# EAGLE design rpiz_test (EAGLE 7.6.0)
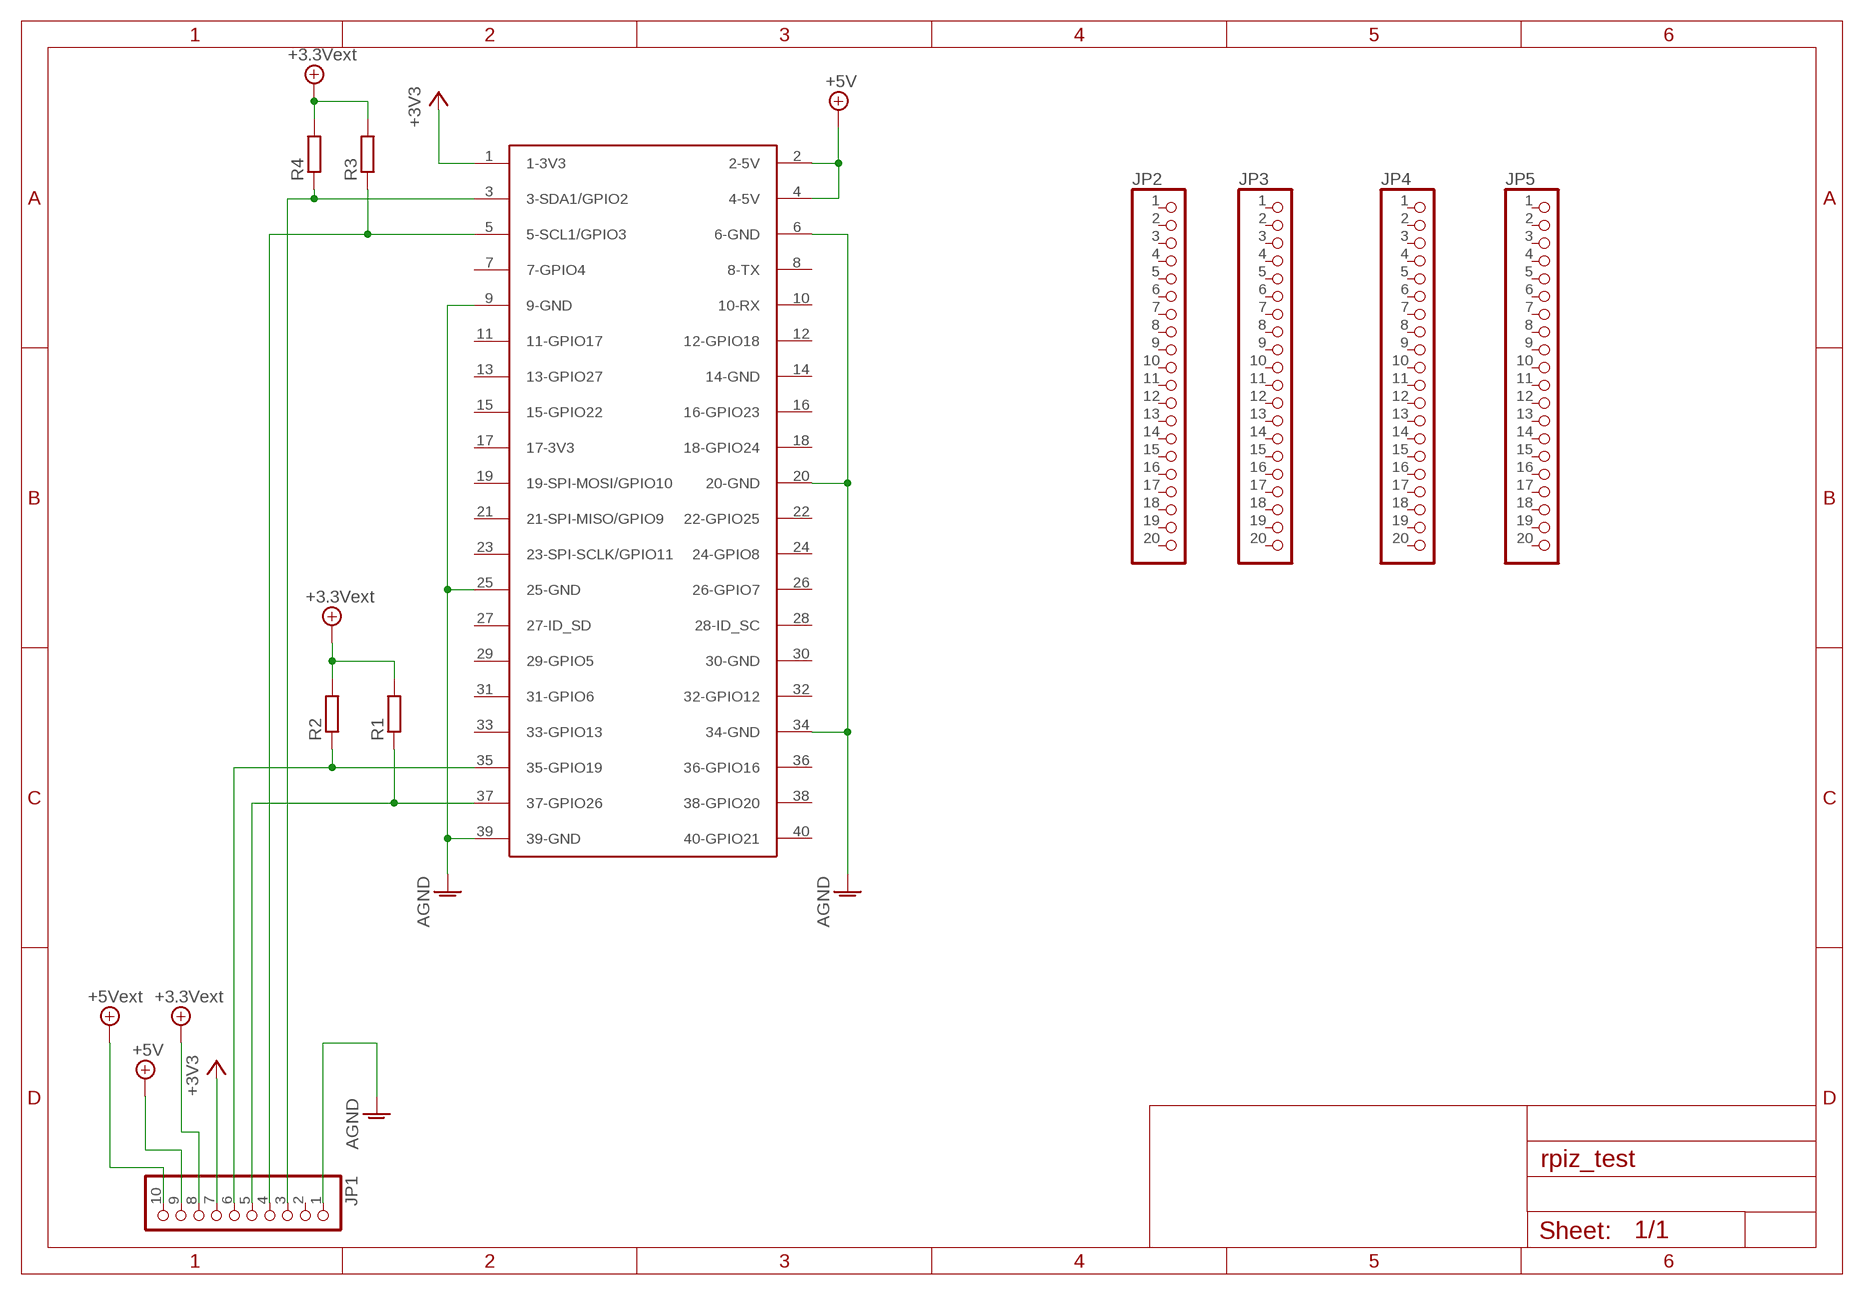
[diagram p0: schematic, sheet 1]

## Parts
JP1  PINHD-1X10  [1X10]
JP2  PINHD-1X20  [1X20]
JP3  PINHD-1X20  [1X20]
JP4  PINHD-1X20  [1X20]
JP5  PINHD-1X20  [1X20]
R1  R-EU_R0805  [R0805]
R2  R-EU_R0805  [R0805]
R3  R-EU_R0805  [R0805]
R4  R-EU_R0805  [R0805]
U$1  RASPBERRY-PI+PIZERO  [RASPBERRY-PI-ZERO]

## Nets
3.3VEXT: JP1.8 R1.2 R2.2 R3.2 R4.2 ; supply symbol labelled +3.3Vext
+3V3: JP1.7 U$1.1(1-3V3)
+5V: JP1.9 U$1.2(2-5V) U$1.4(4-5V)
+5V/1: JP1.10 ; supply symbol labelled +5Vext
AGND: JP1.1 U$1.6(6-GND) U$1.9(9-GND) U$1.20(20-GND) U$1.25(25-GND) U$1.34(34-GND) U$1.39(39-GND)
N$1: JP1.3 R4.1 U$1.3(3-SDA1/GPIO2)
N$2: JP1.4 R3.1 U$1.5(5-SCL1/GPIO3)
N$3: JP1.5 R1.1 U$1.37(37-GPIO26)
N$4: JP1.6 R2.1 U$1.35(35-GPIO19)
Unconnected: JP1.2 JP2.1 JP2.2 JP2.3 JP2.4 JP2.5 JP2.6 JP2.7 JP2.8 JP2.9 JP2.10 JP2.11 JP2.12 JP2.13 JP2.14 JP2.15 JP2.16 JP2.17 JP2.18 JP2.19 JP2.20 JP3.1 JP3.2 JP3.3 JP3.4 JP3.5 JP3.6 JP3.7 JP3.8 JP3.9 JP3.10 JP3.11 JP3.12 JP3.13 JP3.14 JP3.15 JP3.16 JP3.17 JP3.18 JP3.19 JP3.20 JP4.1 JP4.2 JP4.3 JP4.4 JP4.5 JP4.6 JP4.7 JP4.8 JP4.9 JP4.10 JP4.11 JP4.12 JP4.13 JP4.14 JP4.15 JP4.16 JP4.17 JP4.18 JP4.19 JP4.20 JP5.1 JP5.2 JP5.3 JP5.4 JP5.5 JP5.6 JP5.7 JP5.8 JP5.9 JP5.10 JP5.11 JP5.12 JP5.13 JP5.14 JP5.15 JP5.16 JP5.17 JP5.18 JP5.19 JP5.20 U$1.7(7-GPIO4) U$1.8(8-TX) U$1.10(10-RX) U$1.11(11-GPIO17) U$1.12(12-GPIO18) U$1.13(13-GPIO27) U$1.14(14-GND) U$1.15(15-GPIO22) U$1.16(16-GPIO23) U$1.17(17-3V3) U$1.18(18-GPIO24) U$1.19(19-SPI-MOSI/GPIO10) U$1.21(21-SPI-MISO/GPIO9) U$1.22(22-GPIO25) U$1.23(23-SPI-SCLK/GPIO11) U$1.24(24-GPIO8) U$1.26(26-GPIO7) U$1.27(27-ID_SD) U$1.28(28-ID_SC) U$1.29(29-GPIO5) U$1.30(30-GND) U$1.31(31-GPIO6) U$1.32(32-GPIO12) U$1.33(33-GPIO13) U$1.36(36-GPIO16) U$1.38(38-GPIO20) U$1.40(40-GPIO21)

## Library data of the parts
JP1 = pinhead:PINHD-1X10: PIN HEADER
JP2-JP5 = pinhead:PINHD-1X20: PIN HEADER
R1-R4 = rcl:R-EU_: RESISTOR, European symbol
U$1 = Ava:RASPBERRY-PI+: Samtec SSW-120-01-T-D

## Board
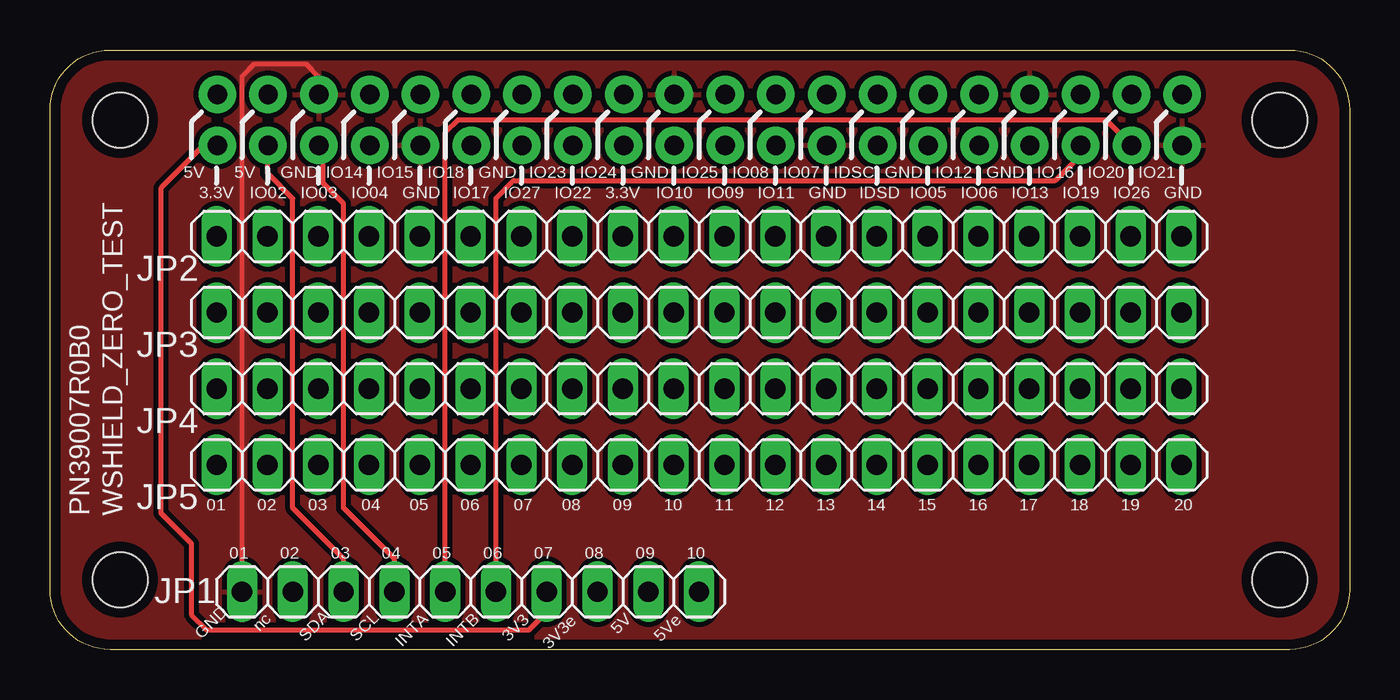
[diagram p1: board, top side]
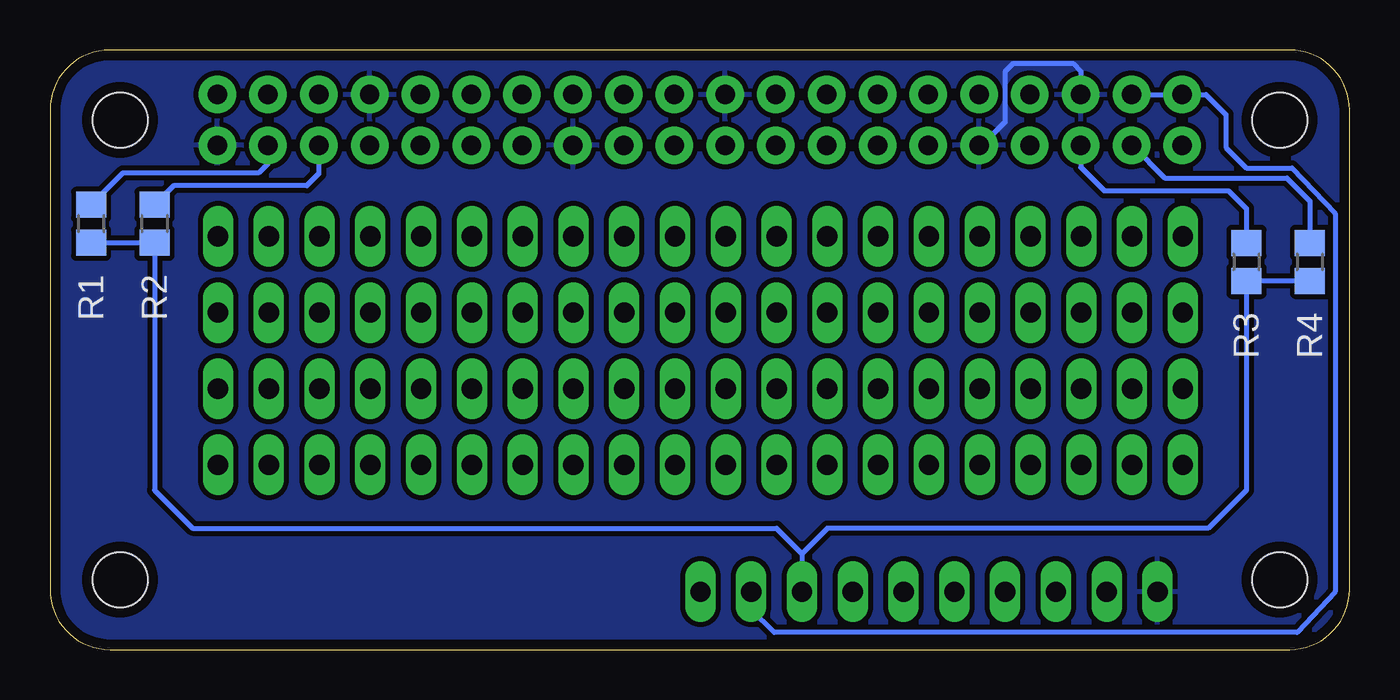
[diagram p2: board, bottom side, seen from below]

Size 65 x 30 mm. Coordinates in mm from the lower left corner, seen from the top.
Copper layers (1*16): Top 0.035mm / dielectric 1.6mm / Bottom 0.035mm
Design rules "Elecrow_2-layer_PCB_eagle_rule": minimum track width 6mil, minimum drill 12mil, track to track 6mil, track to pad 6mil, pad to pad 6mil, via to via 8mil, smd to smd 0mil, copper to edge 20mil, drill to drill 10mil, minimum pad ring 6mil, minimum via ring 6mil, stop-mask expansion 0mil, vias tented up to drill 100mil, thermal gap 10mil

### Footprints (pad centres in the part's own frame; a part is rotated, then mirrored left to right if it is on the bottom)
1X10 = drill 1.016 long: 1 -11.43,0; 2 -8.89,0; 3 -6.35,0; 4 -3.81,0; 5 -1.27,0; 6 1.27,0; 7 3.81,0; 8 6.35,0; 9 8.89,0; 10 11.43,0
1X20 = drill 1.016 long: 1 -24.13,0; 2 -21.59,0; 3 -19.05,0; 4 -16.51,0; 5 -13.97,0; 6 -11.43,0; 7 -8.89,0; 8 -6.35,0; 9 -3.81,0; 10 -1.27,0; 11 1.27,0; 12 3.81,0; 13 6.35,0; 14 8.89,0; 15 11.43,0; 16 13.97,0; 17 16.51,0; 18 19.05,0; 19 21.59,0; 20 24.13,0
R0805 = smd 1.3 x 1.5: 1 -0.95,0; 2 0.95,0
RASPBERRY-PI-ZERO = drill 0.97 pad 1.88: 1 -23.97,23.23; 2 -23.97,25.77; 3 -21.43,23.23; 4 -21.43,25.77; 5 -18.89,23.23; 6 -18.89,25.77; 7 -16.35,23.23; 8 -16.35,25.77; 9 -13.81,23.23; 10 -13.81,25.77; 11 -11.27,23.23; 12 -11.27,25.77; 13 -8.73,23.23; 14 -8.73,25.77; 15 -6.19,23.23; 16 -6.19,25.77; 17 -3.65,23.23; 18 -3.65,25.77; 19 -1.11,23.23; 20 -1.11,25.77; 21 1.43,23.23; 22 1.43,25.77; 23 3.97,23.23; 24 3.97,25.77; 25 6.51,23.23; 26 6.51,25.77; 27 9.05,23.23; 28 9.05,25.77; 29 11.59,23.23; 30 11.59,25.77; 31 14.13,23.23; 32 14.14,25.77; 33 16.67,23.23; 34 16.67,25.77; 35 19.21,23.23; 36 19.21,25.77; 37 21.75,23.23; 38 21.75,25.77; 39 24.29,23.23; 40 24.29,25.77 | hole 2.75: -28.84,24.5; 29.16,24.5; -28.84,1.5; 29.16,1.5

### Placement (x,y rotation side)
JP1  21.04,2.89 0 top
JP2  32.47,20.67 0 top
JP3  32.47,16.86 0 top
JP4  32.47,13.05 0 top
JP5  32.47,9.24 0 top
R1  62.95,21.3 270 bottom
R2  59.77,21.3 270 bottom
R3  5.16,19.4 270 bottom
R4  1.99,19.4 270 bottom
U$1  32.34,2 0 top

### Tracks (layer width: path | path; a pad name or v marks a point on that pad's centre or on a via)
3.3VEXT
  Bottom 0.254: R4.2 R3.2 5.16,7.97 7.07,6.06 26.12,6.06 27.39,4.79 | R1.2 R2.2 59.77,7.97 57.87,6.06 28.66,6.06 27.39,4.79 | 27.39,4.79 JP1.8
+3V3
  Top 0.254: U$1.1 7.69,25.23 5.54,23.08 5.54,6.83 7.07,5.3 7.07,1.75 7.83,0.98 23.96,0.98 24.85,1.87 JP1.7
+5V
  Bottom 0.254: JP1.9 29.93,2 28.78,0.86 2.62,0.86 0.72,2.89 0.72,21.81 2.88,24.1 5.16,24.1 6.18,25.11 6.18,26.76 7.18,27.77 U$1.2 U$1.4
AGND
  Top 0.254: JP1.1 9.61,28.67 10.24,29.3 12.78,29.3 13.42,28.67 13.42,27.8 U$1.6
  Bottom 0.254: U$1.6 13.42,27.8 13.42,28.92 13.8,29.3 16.85,29.3 17.23,28.92 17.23,26.38 18.38,25.23 U$1.9
  pour Top (isolate 0.254): 0.08,27.02 arc-90 3.26,30.19 3.89,30.19 62.31,30.19 arc-90 64.85,27.65 64.85,27.02 64.85,2.89 arc-90 62.31,0.35 61.68,0.35 3.26,0.35 arc-90 0.08,3.52
  pour Bottom (isolate 0.254): 0.08,27.02 arc-90 3.26,30.19 3.89,30.19 62.31,30.19 arc-90 64.85,27.65 64.85,2.89 arc-90 62.31,0.35 61.68,0.35 3.26,0.35 arc-90 0.08,3.52
N$1
  Top 0.254: JP1.3 14.69,4.54 12.15,7.08 12.15,22.57 10.88,23.84 10.88,25.2 U$1.3
  Bottom 0.254: U$1.3 10.87,25.23 9.23,23.59 3.13,23.59 1.99,22.45 R4.1
N$2
  Top 0.254: JP1.4 17.23,4.54 14.69,7.08 14.69,22.32 13.67,23.34 13.67,25.01 U$1.5
  Bottom 0.254: U$1.5 13.45,24.13 12.27,22.95 6.05,22.95 5.16,22.07 R3.1
N$3
  Top 0.254: JP1.5 19.77,25.88 20.4,26.51 52.81,26.51 U$1.37
  Bottom 0.254: U$1.37 54.09,24.32 54.57,23.84 61.36,23.84 R1.1
N$4
  Top 0.254: JP1.6 22.31,22.57 23.2,23.46 50.28,23.46 51.55,24.73 U$1.35
  Bottom 0.254: U$1.35 51.55,23.81 52.15,23.21 58.82,23.21 R2.1

### Text on the board
tNames: 5V | 5V | GND | IO14 | IO15 | IO18 | GND | IO23 | IO24 | GND | IO25 | IO08 | IO07 | IDSC | GND | IO12 | GND | IO16 | IO20 | IO21 | 3.3V | IO02 | IO03 | IO04 | GND | IO17 | IO27 | IO22 | 3.3V | IO10 | IO09 | IO11 | GND | IDSD | IO05 | IO06 | IO13 | IO19 | IO26 | GND | PN39007R0B0 | WSHIELD_ZERO_TEST | 01 | 02 | 03 | 04 | 05 | 06 | 07 | 08 | 09 | 10 | 11 | 12 | 13 | 14 | 15 | 16 | 17 | 18 | 19 | 20 | 01 | 02 | 03 | 04 | 05 | 06 | 07 | 08 | 09 | 10 | GND | nc | SDA | SCL | 3V3 | 5V | 5Ve | INTA | INTB | 3V3e